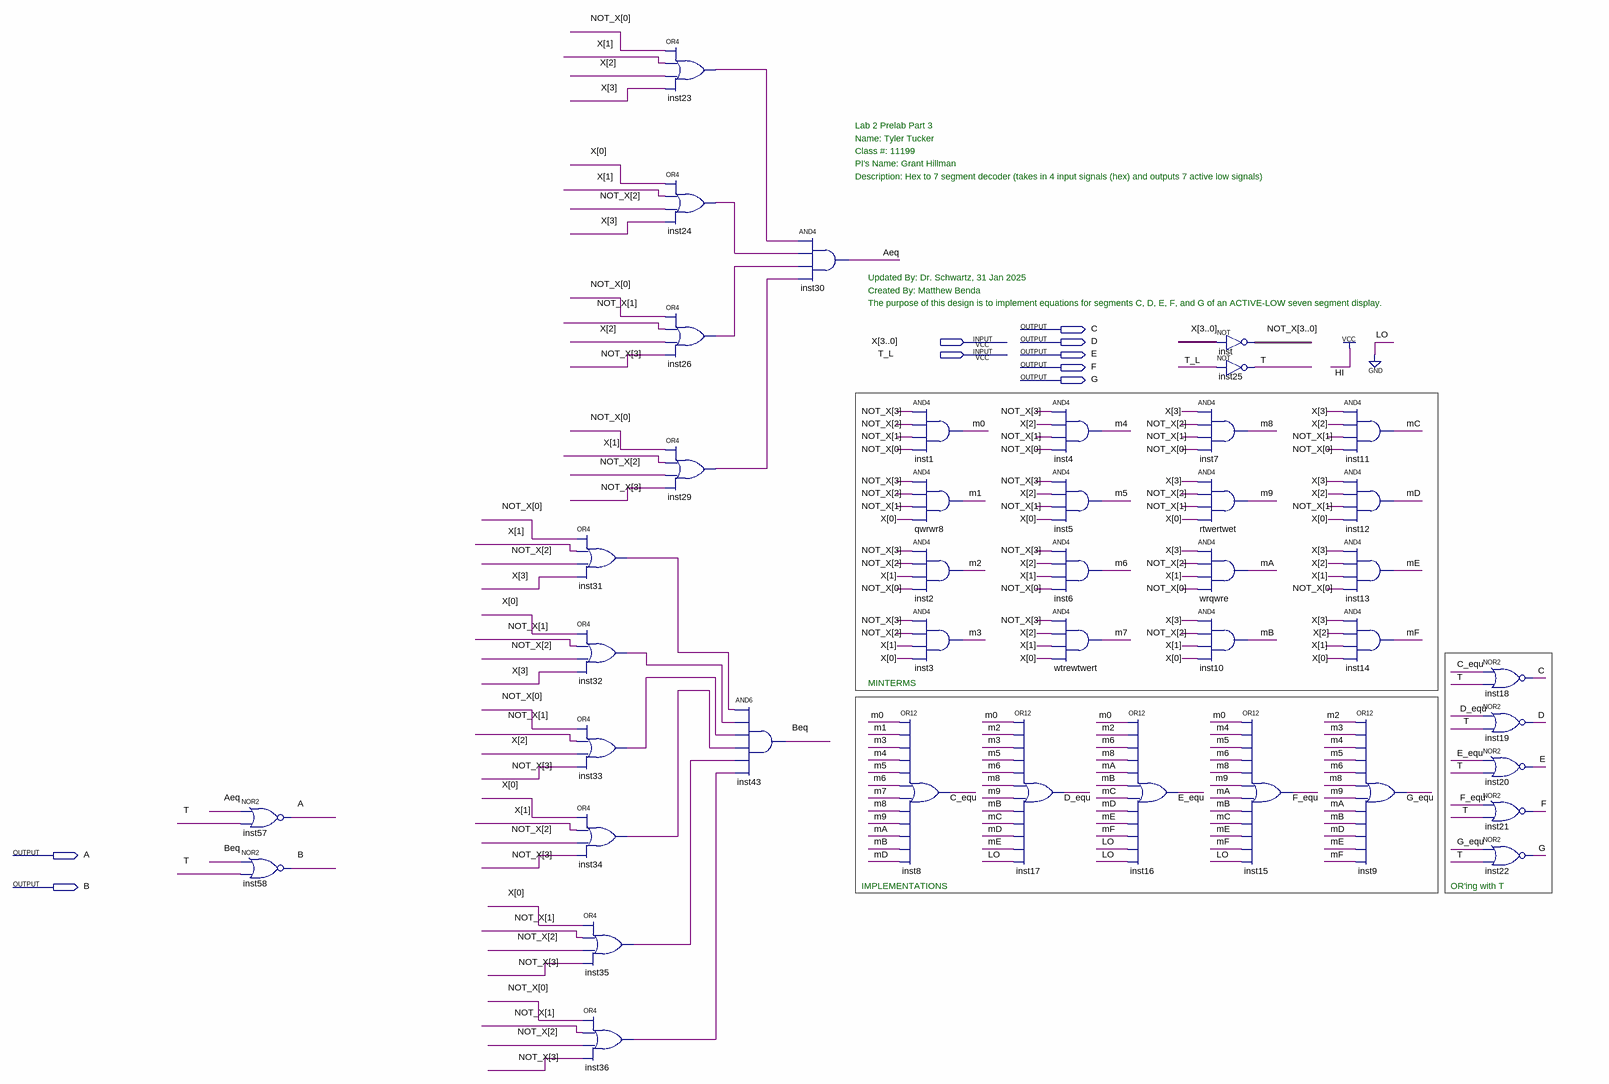
[diagram p0: schematic sheet]
// Quartus schematic lab2_decoder.bdf as structural Verilog: 42 symbols, 9 pins
module lab2_decoder (
  input  [3:0] X,
  input  T_L,
  output C,
  output D,
  output E,
  output F,
  output G,
  output A,
  output B
);

  wire Aeq, Beq, C_equ, D_equ, E_equ, F_equ, G_equ, inst23_out, inst24_out, inst26_out, inst29_out,
       inst31_out, inst32_out, inst33_out, inst34_out, inst35_out, inst36_out, m0, m1, m2, m3, m4, m5, m6,
       m7, m8, m9, mA, mB, mC, mD, mE, mF, T;
  wire [3:0] NOT_X;

  nor inst57 (A, Aeq, T);
  nor inst58 (B, Beq, T);
  or inst31 (inst31_out, NOT_X[0], X[1], NOT_X[2], X[3]);
  or inst32 (inst32_out, X[0], NOT_X[1], NOT_X[2], X[3]);
  or inst33 (inst33_out, NOT_X[0], NOT_X[1], X[2], NOT_X[3]);
  or inst34 (inst34_out, X[0], X[1], NOT_X[2], NOT_X[3]);
  or inst35 (inst35_out, X[0], NOT_X[1], NOT_X[2], NOT_X[3]);
  or inst36 (inst36_out, NOT_X[0], NOT_X[1], NOT_X[2], NOT_X[3]);
  or inst23 (inst23_out, NOT_X[0], X[1], X[2], X[3]);
  or inst24 (inst24_out, X[0], X[1], NOT_X[2], X[3]);
  or inst26 (inst26_out, NOT_X[0], NOT_X[1], X[2], NOT_X[3]);
  or inst29 (inst29_out, NOT_X[0], X[1], NOT_X[2], NOT_X[3]);
  and inst43 (Beq, inst31_out, inst32_out, inst33_out, inst34_out, inst35_out, inst36_out);
  and inst30 (Aeq, inst23_out, inst24_out, inst26_out, inst29_out);
  and inst1 (m0, NOT_X[3], NOT_X[2], NOT_X[1], NOT_X[0]);
  and qwrwr8 (m1, NOT_X[3], NOT_X[2], NOT_X[1], X[0]);
  and inst2 (m2, NOT_X[3], NOT_X[2], X[1], NOT_X[0]);
  and inst3 (m3, NOT_X[3], NOT_X[2], X[1], X[0]);
  or inst8 (C_equ, m0, m1, m3, m4, m5, m6, m7, m8, m9, mA, mB, mD);
  or inst17 (D_equ, m0, m2, m3, m5, m6, m8, m9, mB, mC, mD, mE, 1'b0);
  and inst4 (m4, NOT_X[3], X[2], NOT_X[1], NOT_X[0]);
  and inst5 (m5, NOT_X[3], X[2], NOT_X[1], X[0]);
  and inst6 (m6, NOT_X[3], X[2], X[1], NOT_X[0]);
  and wtrewtwert (m7, NOT_X[3], X[2], X[1], X[0]);
  or inst16 (E_equ, m0, m2, m6, m8, mA, mB, mC, mD, mE, mF, 1'b0, 1'b0);
  assign NOT_X = ~X;  // NOT inst, 4 bits wide
  not inst25 (T, T_L);
  and inst7 (m8, X[3], NOT_X[2], NOT_X[1], NOT_X[0]);
  and rtwertwet (m9, X[3], NOT_X[2], NOT_X[1], X[0]);
  and wrqwre (mA, X[3], NOT_X[2], X[1], NOT_X[0]);
  and inst10 (mB, X[3], NOT_X[2], X[1], X[0]);
  or inst15 (F_equ, m0, m4, m5, m6, m8, m9, mA, mB, mC, mE, mF, 1'b0);
  and inst11 (mC, X[3], X[2], NOT_X[1], NOT_X[0]);
  and inst12 (mD, X[3], X[2], NOT_X[1], X[0]);
  and inst13 (mE, X[3], X[2], X[1], NOT_X[0]);
  and inst14 (mF, X[3], X[2], X[1], X[0]);
  or inst9 (G_equ, m2, m3, m4, m5, m6, m8, m9, mA, mB, mD, mE, mF);
  nor inst18 (C, C_equ, T);
  nor inst19 (D, D_equ, T);
  nor inst20 (E, E_equ, T);
  nor inst21 (F, F_equ, T);
  nor inst22 (G, G_equ, T);

  // Notes on the sheet:
  //   Lab 2 Prelab Part 3
  //   Name: Tyler Tucker
  //   Class #: 11199
  //   PI's Name: Grant Hillman
  //   Description: Hex to 7 segment decoder (takes in 4 input signals (hex) and outputs 7 active low signals)  
  //   Updated By: Dr. Schwartz, 31 Jan 2025
  //   Created By: Matthew Benda
  //   The purpose of this design is to implement equations for segments C, D, E, F, and G of an ACTIVE-LOW seven segment display.            
  //   MINTERMS
  //   IMPLEMENTATIONS
  //   OR'ing with T
endmodule
